# EAGLE design io-board-Bpod (EAGLE 6.3)
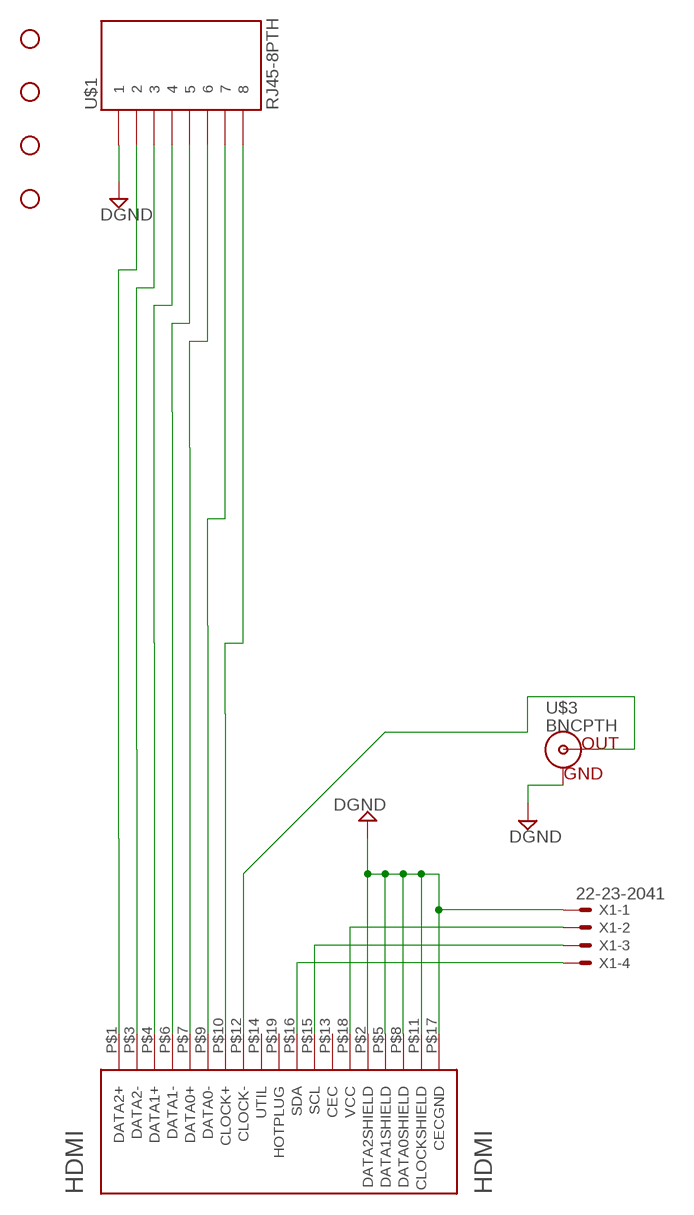
[diagram p0: schematic, sheet 1]

## Parts
HDMI  HDMI  [HDMI_A]
STANDOFF1  STAND-OFF  [STAND-OFF]
STANDOFF2  STAND-OFF  [STAND-OFF]
STANDOFF3  STAND-OFF  [STAND-OFF]
STANDOFF4  STAND-OFF  [STAND-OFF]
U$1  RJ45-8PTH  [RJ45-8]
U$3  BNCPTH  [BNC]
X1  22-23-2041  [22-23-2041]

## Nets
CH6: HDMI.P$9(DATA0-) U$1.7
DGND: HDMI.P$2(DATA2SHIELD) HDMI.P$5(DATA1SHIELD) HDMI.P$8(DATA0SHIELD) HDMI.P$11(CLOCKSHIELD) HDMI.P$17(CECGND) U$1.1 U$3.GND X1.1
I2C_CLK: HDMI.P$15(SCL) X1.3
I2C_DAT: HDMI.P$16(SDA) X1.4
N$1: HDMI.P$12(CLOCK-) U$3.S(OUT)
N$2: HDMI.P$4(DATA1+) U$1.4
N$3: HDMI.P$3(DATA2-) U$1.3
N$4: HDMI.P$1(DATA2+) U$1.2
N$5: HDMI.P$7(DATA0+) U$1.6
N$7: HDMI.P$10(CLOCK+) U$1.8
N$23: HDMI.P$6(DATA1-) U$1.5
VCC: HDMI.P$18(VCC) X1.2
Unconnected: HDMI.P$13(CEC) HDMI.P$14(UTIL) HDMI.P$19(HOTPLUG)

## Library data of the parts
HDMI = open-ephys:HDMI: Horizonal HDMI type "A" jack
STANDOFF1-STANDOFF4 = SparkFun-Electromechanical:STAND-OFF: #4 Stand Off This is the mechanical footprint for a #4 phillips button head screw. Use the keepout ring to avoid running the screw head into surrounding components. SKU : PRT-00447
U$1 = SparkFun-Connectors:RJ45-8: RJ45 Jack Simple RJ45, 8-pin connection - connector for common Cat5, Cat5e, and Cat6 Ethernet cables. Footprint not yet proven in production. Connector sku is PRT-00643; Breakout PCB sku is BOB-00716.
U$3 = SparkFun:BNC: BNC Connector, Mouser Part# 5227161
X1 = con-molex:22-23-2041: .100" (2.54mm) Center Header - 4 Pin; MF: MOLEX; MPN: 22-23-2041; OC_FARNELL: 1462920; OC_NEWARK: 38C0355

## Board
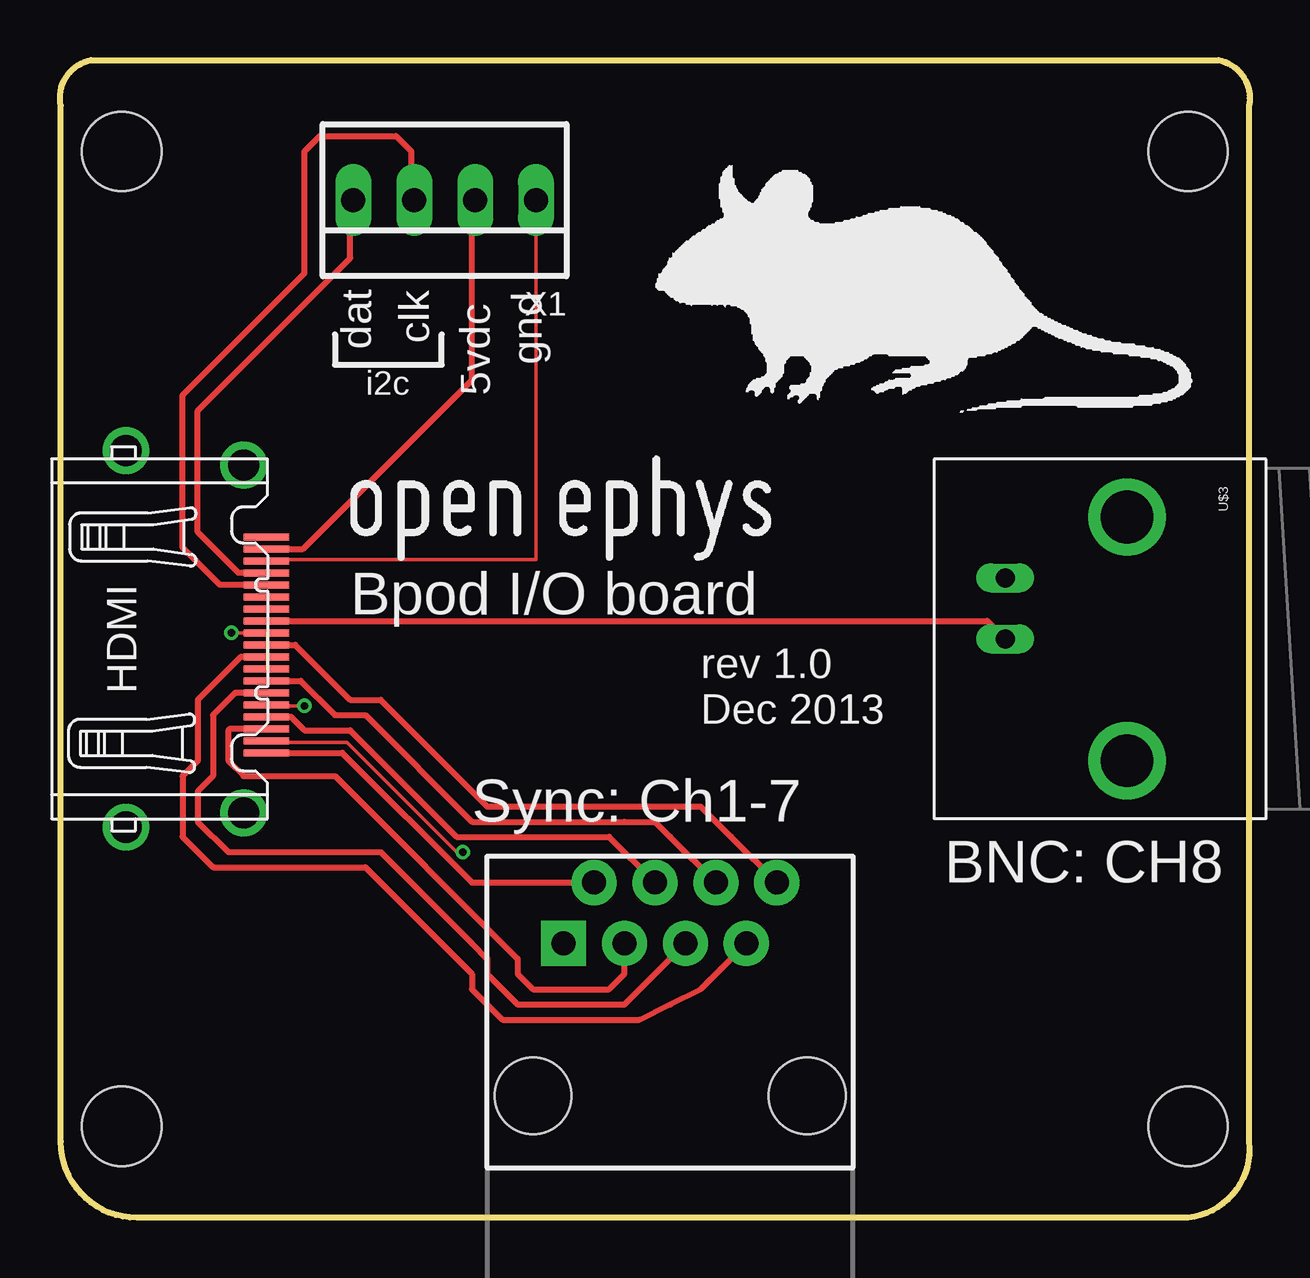
[diagram p1: board, top side]
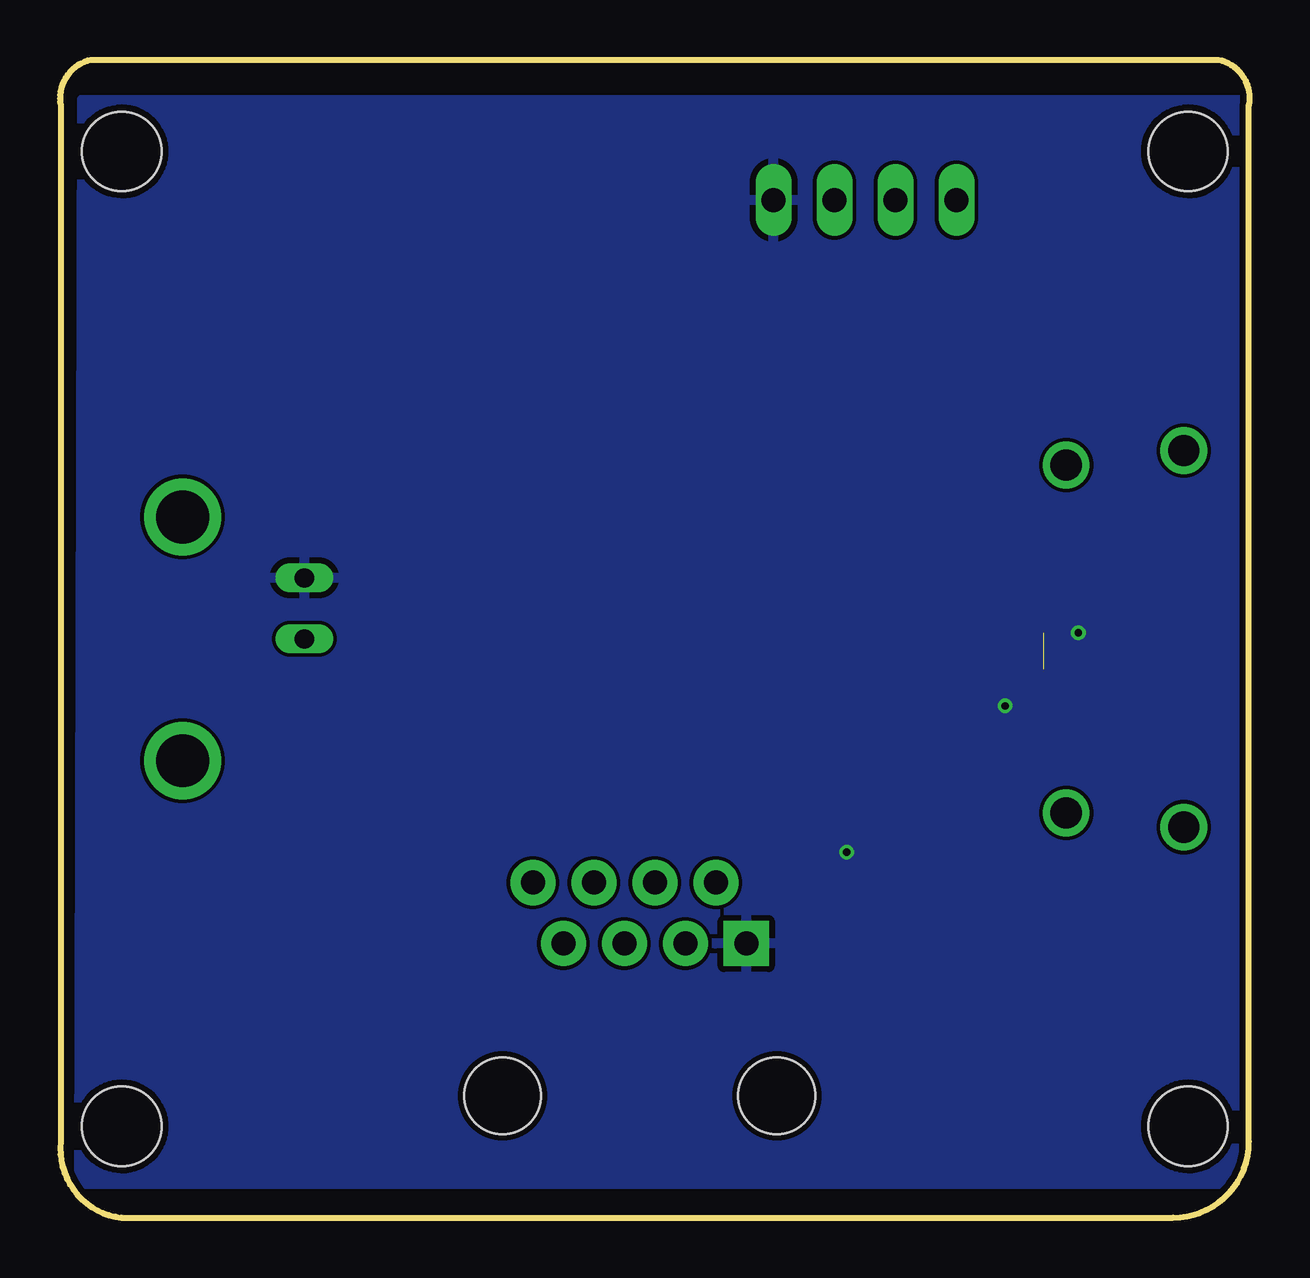
[diagram p2: board, bottom side, seen from below]

Size 49.59 x 48.26 mm. Coordinates in mm from the lower left corner, seen from the top.
Outline: 49.56,46.36 49.56,3.18 arc-90 47.02,0 3.21,0 arc-90 0.03,3.18 0.03,46.36 arc-90 1.3,48.26 48.29,48.26 arc-90 49.56,46.36
Copper layers (1*2*15*16): Top 0.035mm / dielectric 0.2mm / Route2 0.0175mm / dielectric 1.1mm / Route15 0.0175mm / dielectric 0.2mm / Bottom 0.035mm
Design rules "SeeedStudio_DRU_no_angle_20130527": minimum track width 6mil, minimum drill 12mil, track to track 6mil, track to pad 6mil, pad to pad 6mil, via to via 6mil, smd to smd 0mil, copper to edge 10mil, drill to drill 10mil, minimum pad ring 6mil, minimum via ring 6mil, stop-mask expansion 2mil, vias tented up to drill 25mil, thermal gap 10mil

### Footprints (pad centres in the part's own frame; a part is rotated, then mirrored left to right if it is on the bottom)
HDMI_A = smd 0.3 x 1.9: P$1 4.75,0.95; P$2 4.25,0.95; P$3 3.75,0.95; P$4 3.25,0.95; P$5 2.75,0.95; P$6 2.25,0.95; P$7 1.75,0.95; P$8 1.25,0.95; P$9 0.75,0.95; P$10 0.25,0.95; P$11 -0.25,0.95; P$12 -0.75,0.95; P$13 -1.25,0.95; P$14 -1.75,0.95; P$15 -2.25,0.95; P$16 -2.75,0.95; P$17 -3.25,0.95; P$18 -3.75,0.95; P$19 -4.25,0.95 | drill 1.3: P$20 -7.25,0; P$21 7.25,0; P$22 7.85,-4.9; P$23 -7.85,-4.9
STAND-OFF = hole 3.302: 0,0
RJ45-8 = drill 1 pad 1.88 square: 1 -4.445,6.35 | drill 1 pad 1.88: 2 -3.175,8.89; 3 -1.905,6.35; 4 -0.635,8.89; 5 0.635,6.35; 6 1.905,8.89; 7 3.175,6.35; 8 4.445,8.89 | hole 3.2: -5.715,0; 5.715,0
BNC = drill 2.2: 3 -5.08,5.08; 4 5.08,5.08 | drill 0.8 long: GND -2.54,0; S 0,0
22-23-2041 = drill 1 long: 1 -3.81,0; 2 -1.27,0; 3 1.27,0; 4 3.81,0

### Placement (x,y rotation side)
HDMI  7.65,24.13 270 top
STANDOFF1  2.57,3.81 0 top
STANDOFF2  47.02,3.81 0 top
STANDOFF3  2.57,44.45 0 top
STANDOFF4  47.02,44.45 0 top
U$1  25.43,5.08 0 top
U$2  [OPEN_EPHYS_LOGO]  11.46,26.92 0 top
U$3  39.4,24.13 270 top
U$4  [MOUSELOGO]  22.89,45.72 270 top
X1  16.03,42.42 180 top

### Tracks (layer width: path | path; a pad name or v marks a point on that pad's centre or on a via)
CH6
  Top 0.254: HDMI.P$9 7.54,23.38 5.75,21.59 5.75,19.05 5.11,18.41 5.11,15.88 6.38,14.61 12.73,14.61 17.18,10.16 17.18,9.53 18.45,8.26 24.16,8.26 25.43,8.89 26.7,9.53 U$1.7
DGND  (via drill 0.3)  (1 unrouted)
  Top 0.152: v16.8,15.24 16.54,15.24 11.97,19.81 8.67,19.81 HDMI.P$2 | v10.19,21.34 8.67,21.34 HDMI.P$5 | v7.14,24.38 8.41,24.38 HDMI.P$11 | X1.1 19.84,27.43 8.67,27.43 HDMI.P$17
  pour Bottom: 48.67,46.61 0.29,46.61 0.41,1.4 48.8,1.4
I2C_CLK
  Top 0.254: HDMI.P$15 6.67,26.38 5.11,27.94 5.11,34.29 10.19,39.37 10.19,44.45 10.83,45.09 14,45.09 14.64,44.45 14.64,42.55 X1.3
I2C_DAT
  Top 0.254: HDMI.P$16 7.44,26.88 5.75,28.58 5.75,33.66 12.1,40.01 12.1,42.29 X1.4
N$1
  Top 0.254: HDMI.P$12 38.65,24.88 U$3.S
N$2
  Top 0.254: HDMI.P$4 9.63,20.88 10.19,20.32 12.1,20.32 16.54,15.88 22.89,15.88 U$1.4
N$3
  Top 0.254: HDMI.P$3 7.08,20.38 7.02,20.32 7.02,19.05 7.65,18.41 11.46,18.41 19.08,10.8 19.08,10.16 19.72,9.53 22.89,9.53 23.53,10.16 U$1.3
N$4
  Top 0.254: HDMI.P$1 11.77,19.38 17.18,13.97 U$1.2
N$5
  Top 0.254: HDMI.P$7 10.04,22.38 11.46,20.96 12.73,20.96 17.18,16.51 23.53,16.51 24.8,16.51 25.43,15.88 U$1.6
N$7
  Top 0.254: HDMI.P$10 9.81,23.88 12.1,21.59 13.37,21.59 17.81,17.15 24.16,17.15 26.7,17.15 27.97,15.88 U$1.8
N$23
  Top 0.254: HDMI.P$6 7.31,21.88 6.38,20.96 6.38,18.41 5.75,17.78 5.75,16.51 7.02,15.24 13.37,15.24 17.18,11.43 17.81,10.8 17.81,10.16 19.08,8.89 23.53,8.89 U$1.5
VCC
  Top 0.254: HDMI.P$18 10.13,27.88 17.18,34.93 17.18,42.29 X1.2

### Text on the board
tPlace: clk | dat | gnd | i2c | 5vdc | Bpod I/O board | rev 1.0 | Dec 2013 | Sync: Ch1-7 | BNC: CH8